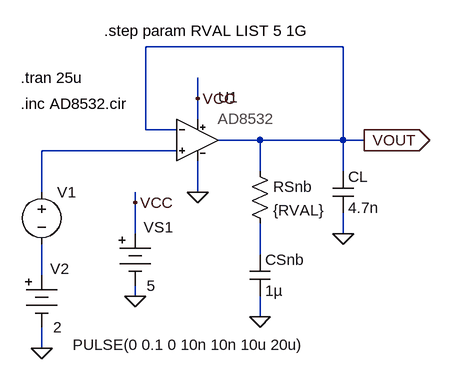
[diagram p0: schematic fig-03-01-42.asc]
fig-03-01-42.asc, the LTspice schematic file:
Version 4
SHEET 1 880 680
WIRE 432 32 128 32
WIRE 208 112 208 80
WIRE 208 144 208 112
WIRE 128 160 128 32
WIRE 176 160 128 160
WIRE 304 176 240 176
WIRE 432 176 432 32
WIRE 432 176 304 176
WIRE 464 176 432 176
WIRE 176 192 -32 192
WIRE 304 224 304 176
WIRE 432 224 432 176
WIRE -32 256 -32 192
WIRE 208 256 208 208
WIRE 112 272 112 256
WIRE 112 320 112 272
WIRE 432 320 432 288
WIRE 304 352 304 304
WIRE -32 384 -32 336
WIRE 112 416 112 400
WIRE 304 448 304 416
WIRE -32 496 -32 464
FLAG -32 496 0
FLAG 464 176 VOUT
IOPIN 464 176 Out
FLAG 112 416 0
FLAG 112 272 VCC
FLAG 208 112 VCC
FLAG 432 320 0
FLAG 208 256 0
FLAG 304 448 0
SYMBOL Misc\\battery 112 304 R0
WINDOW 0 13 6 Left 2
WINDOW 3 18 96 Left 2
SYMATTR InstName VS1
SYMATTR Value 5
SYMBOL voltage -32 240 R0
WINDOW 3 48 251 Left 2
WINDOW 123 0 0 Left 0
WINDOW 39 0 0 Left 0
SYMATTR Value PULSE(0 0.1 0 10n 10n 10u 20u)
SYMATTR InstName V1
SYMBOL cap 416 224 R0
SYMATTR InstName CL
SYMATTR Value 4.7n
SYMBOL Misc\\battery -32 368 R0
WINDOW 0 13 6 Left 2
WINDOW 3 18 96 Left 2
WINDOW 123 0 0 Left 0
WINDOW 39 0 0 Left 0
SYMATTR InstName V2
SYMATTR Value 2
SYMBOL AD8532 208 112 R0
WINDOW 0 32 -2 Left 2
SYMATTR InstName U1
SYMBOL res 288 208 R0
SYMATTR InstName RSnb
SYMATTR Value {RVAL}
SYMBOL cap 288 352 R0
SYMATTR InstName CSnb
SYMATTR Value 1µ
TEXT -64 80 Left 2 !.tran 25u
TEXT -64 120 Left 2 !.inc AD8532.cir
TEXT 64 8 Left 2 !.step param RVAL LIST 5 1G

The netlist it stands for:
* fig-03-01-42.asc
VS1 VCC 0 5
V1 N001 N003 PULSE(0 0.1 0 10n 10n 10u 20u)
CL VOUT 0 4.7n
V2 N003 0 2
XU1 N001 VOUT VCC 0 VOUT AD8532_5  ; pins In+ In- V+ V- OUT
RSnb VOUT N002 {RVAL}
CSnb N002 0 1µ
.tran 25u
.inc AD8532.cir
.step param RVAL LIST 5 1G
.backanno
.end